# Altium schematic sheet ESP8266.SchDoc
size A3; Revision: 7
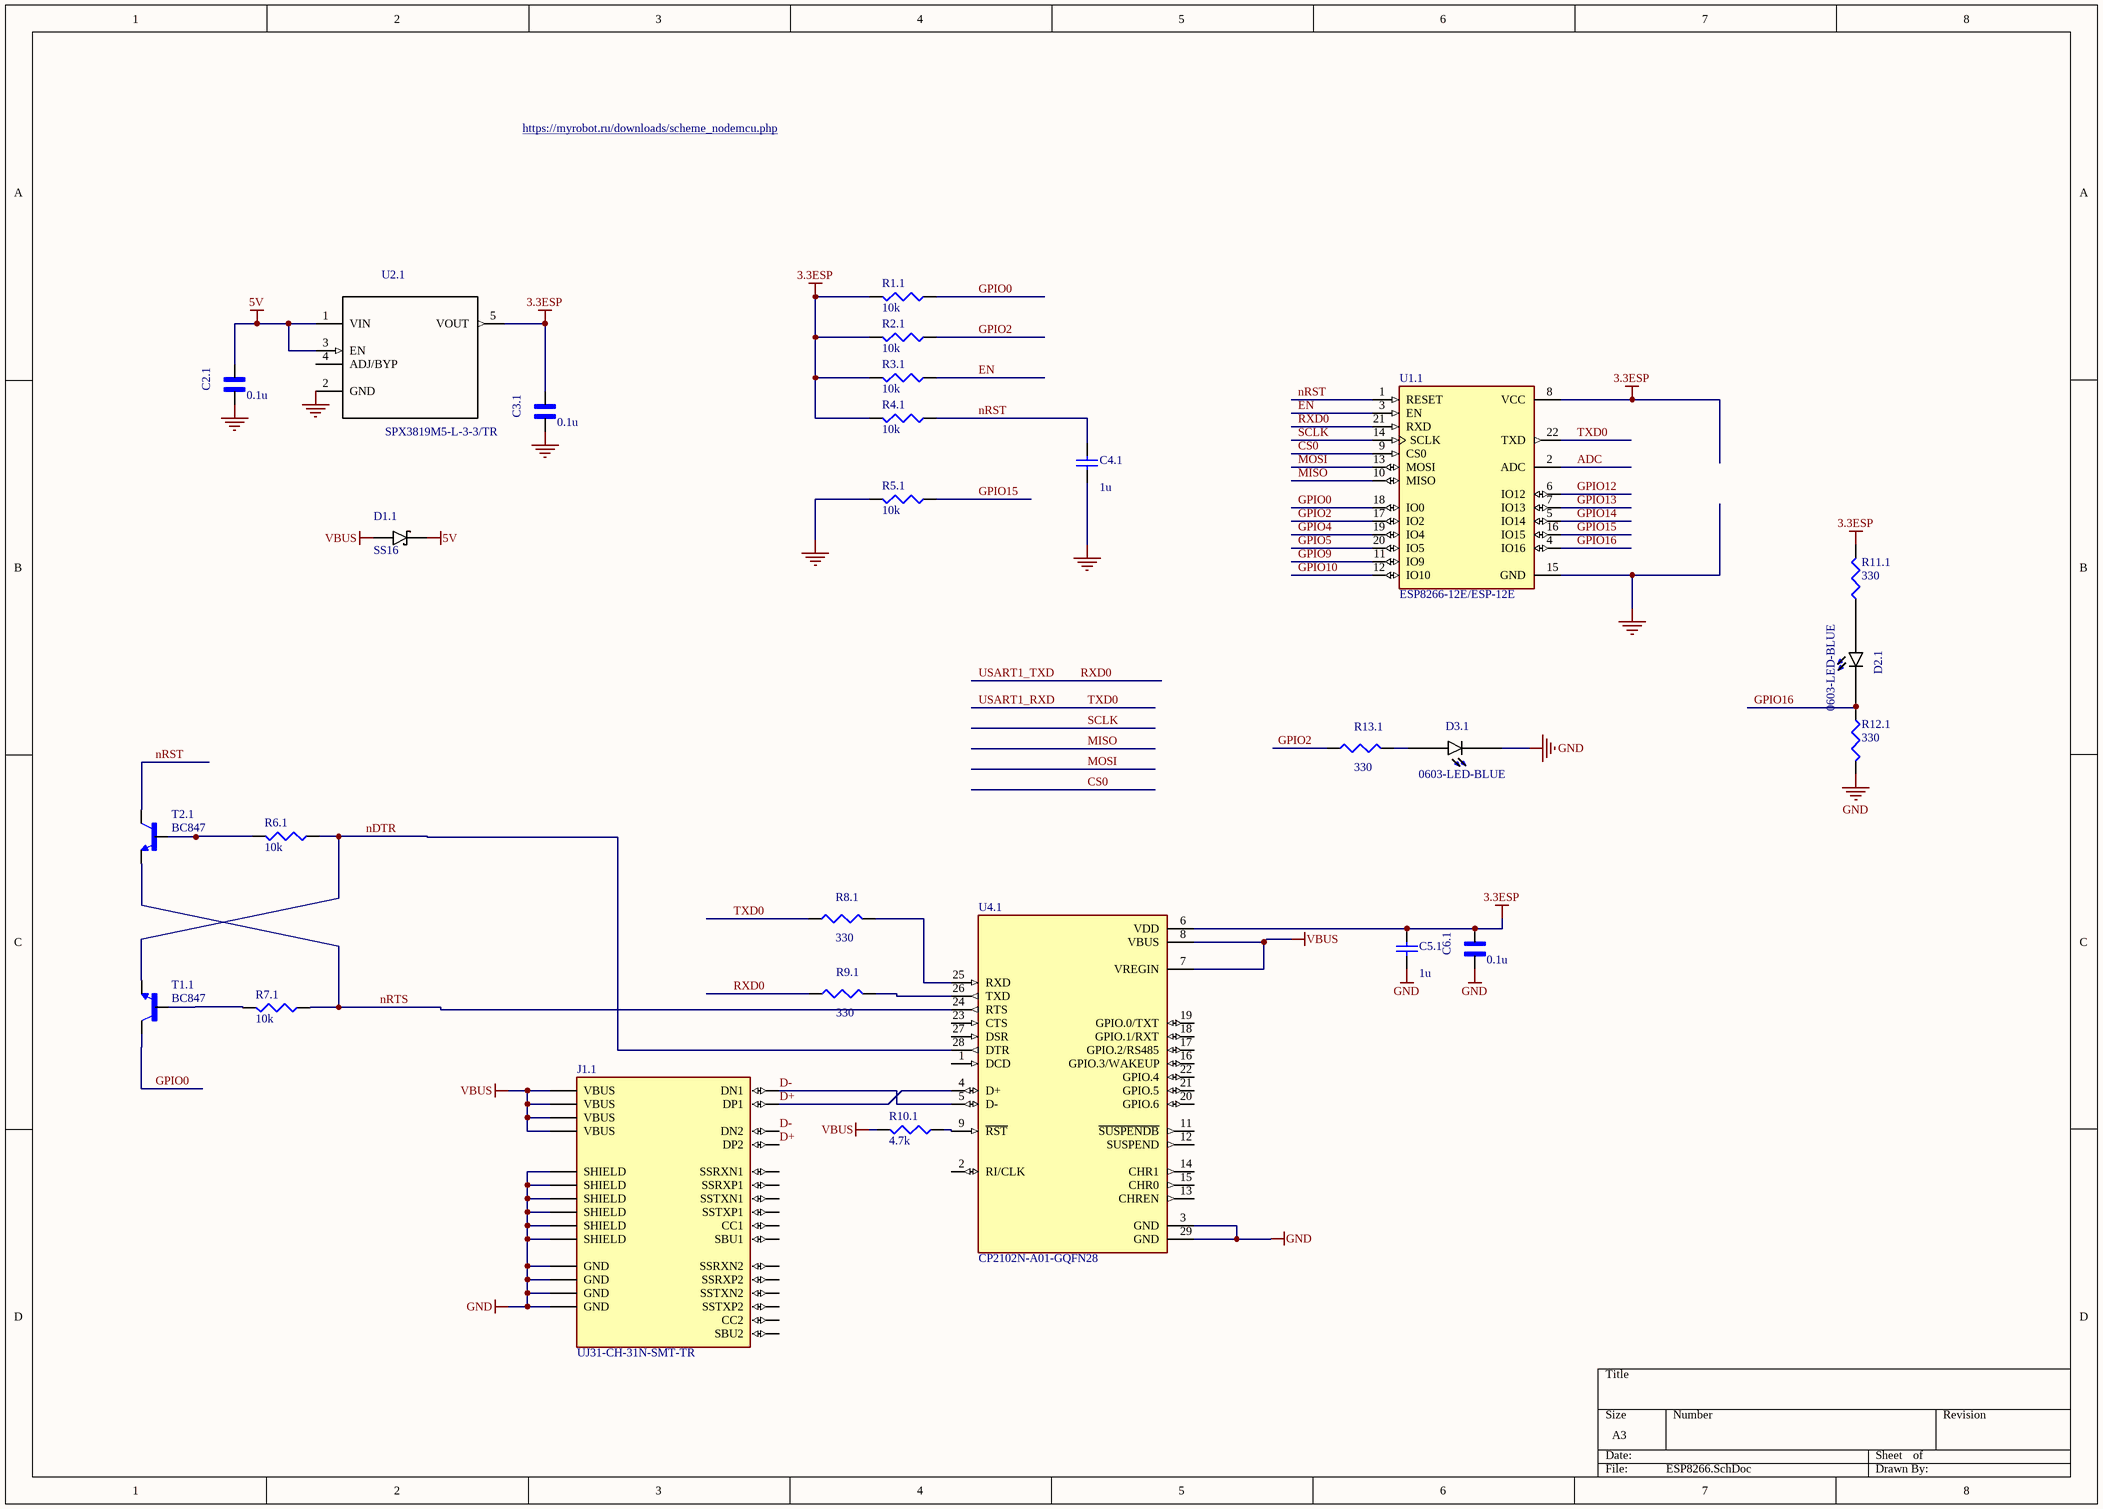
[diagram p0: ESP8266.SchDoc]

## Parts
C2.1  value 0.1u  [*CAPC1608X90]  (hidden comment: GX035C104MAT2-500)
C3.1  value 0.1u  [*CAPC1608X90]  (hidden comment: GX035C104MAT2-500)
C4.1  value 1u  [1608[0603]]  (hidden comment: Cap Semi)
C5.1  value 1u  [1608[0603]]  (hidden comment: Cap Semi)
C6.1  value 0.1u  [*CAPC1608X90]  (hidden comment: GX035C104MAT2-500)
D1.1  SS16  [*DIOM5227X250N_SS16(Primary)]
D2.1  0603-LED-BLUE  [*LEDM1608X80_LTE-C1906R-14(Primary)]
D3.1  0603-LED-BLUE  [*LEDM1608X80_LTE-C1906R-14(Primary)]
J1.1  UJ31-CH-31N-SMT-TR  [CUI_UJ31-CH-31N-SMT-TR]
R1.1  value 10k  [J1-0603]  (hidden comment: Res3)
R2.1  value 10k  [J1-0603]  (hidden comment: Res3)
R3.1  value 10k  [J1-0603]  (hidden comment: Res3)
R4.1  value 10k  [J1-0603]  (hidden comment: Res3)
R5.1  value 10k  [J1-0603]  (hidden comment: Res3)
R6.1  value 10k  [J1-0603]  (hidden comment: Res3)
R7.1  value 10k  [J1-0603]  (hidden comment: Res3)
R8.1  value 330  [J1-0603]  (hidden comment: Res3)
R9.1  value 330  [J1-0603]  (hidden comment: Res3)
R10.1  value 4.7k  [J1-0603]  (hidden comment: Res3)
R11.1  value 330  [J1-0603]  (hidden comment: Res3)
R12.1  value 330  [J1-0603]  (hidden comment: Res3)
R13.1  value 330  [J1-0603]  (hidden comment: Res3)
T1.1  BC847  [SOT23]
T2.1  BC847  [SOT23]
U1.1  ESP8266-12E/ESP-12E  [XCVR_ESP8266-12E/ESP-12E]
U2.1  SPX3819M5-L-3-3/TR  [*SOT95P280X145-5N]
U4.1  CP2102N-A01-GQFN28  [QFN50P500X500X80-29N]

## Nets
3.3ESP: C3.1.1 C5.1.1 C6.1.1 R1.1.2 R2.1.2 R3.1.2 R4.1.2 R11.1.2 U1.1.8(VCC) U2.1.5(VOUT) U4.1.6(VDD)
5V: C2.1.1 D1.1.C(K) U2.1.1(VIN) U2.1.3(EN)
GND: C2.1.2 C3.1.2 C4.1.2 C5.1.2 C6.1.2 D3.1.C J1.1.A1(GND) J1.1.A12(GND) J1.1.B1(GND) J1.1.B12(GND) J1.1.SH1(SHIELD) J1.1.SH2(SHIELD) J1.1.SH3(SHIELD) J1.1.SH4(SHIELD) J1.1.SH5(SHIELD) J1.1.SH6(SHIELD) R5.1.2 R12.1.2 U1.1.15(GND) U2.1.2(GND) U4.1.3(GND) U4.1.29(GND)
VBUS: D1.1.A J1.1.A4(VBUS) J1.1.A9(VBUS) J1.1.B4(VBUS) J1.1.B9(VBUS) R10.1.2 U4.1.7(VREGIN) U4.1.8(VBUS)
ADC: U1.1.2(ADC)
CS0: U1.1.9(CS0)
D+: J1.1.A6(DP1) J1.1.B6(DP2) U4.1.4(D+)
D-: J1.1.A7(DN1) J1.1.B7(DN2) U4.1.5(D-)
EN: R3.1.1 U1.1.3(EN)
GPIO0: R1.1.1 T1.1.3(C) U1.1.18(IO0)
GPIO2: R2.1.1 R13.1.1 U1.1.17(IO2)
GPIO4: U1.1.19(IO4)
GPIO5: U1.1.20(IO5)
GPIO9: U1.1.11(IO9)
GPIO10: U1.1.12(IO10)
GPIO12: U1.1.6(IO12)
GPIO13: U1.1.7(IO13)
GPIO14: U1.1.5(IO14)
GPIO15: R5.1.1 U1.1.16(IO15)
GPIO16: D2.1.C R12.1.1 U1.1.4(IO16)
MISO: U1.1.10(MISO)
MOSI: U1.1.13(MOSI)
nDTR: R6.1.1 T1.1.2(E) U4.1.28(DTR)
nRST: C4.1.1 R4.1.1 T2.1.3(C) U1.1.1(RESET)
nRTS: R7.1.1 T2.1.2(E) U4.1.24(RTS)
RXD0: R9.1.1 U1.1.21(RXD)  [also labelled USART1_TXD]
SCLK: U1.1.14(SCLK)
TXD0: R8.1.1 U1.1.22(TXD)  [also labelled USART1_RXD]
NetD2.1_A: D2.1.A R11.1.1
NetD3.1_A: D3.1.A R13.1.2
NetR6.1_2: R6.1.2 T2.1.1(B)
NetR7.1_2: R7.1.2 T1.1.1(B)
NetR8.1_2: R8.1.2 U4.1.25(RXD)
NetR9.1_2: R9.1.2 U4.1.26(TXD)
NetR10.1_1: R10.1.1 U4.1.9(~{RST})

Not connected (* = marked no-connect by the designer): J1.1 A2(SSTXP1) A3(SSTXN1) A5(CC1) A8(SBU1) A10(SSRXN2) A11(SSRXP2) B2(SSTXP2) B3(SSTXN2) B5(CC2) B8(SBU2) B10(SSRXN1) B11(SSRXP1); U2.1 4(ADJ/BYP); U4.1 1(DCD) 2(RI/CLK) 11(~{SUSPENDB}) 12(SUSPEND) 13(CHREN) 14(CHR1) 15(CHR0) 16(GPIO.3/WAKEUP) 17(GPIO.2/RS485) 18(GPIO.1/RXT) 19(GPIO.0/TXT) 20(GPIO.6) 21(GPIO.5) 22(GPIO.4) 23(CTS) 27(DSR)

## Notes on the sheet
- https://myrobot.ru/downloads/scheme_nodemcu.php

## Library data of the parts
C2.1 C3.1 = GX035C104MAT2-500: Cap Thin Film 0.1uf 50v 0603; MF: AVX; Pacage Metric: 1608; Type: SMD; Package: 0603 AVX; MP: GX035C104MAT2-500; SnapEDA_Link: https://www.snapeda.com/parts/GX035C104MAT2-500/AVX/view-part/?ref=snap
C4.1 C5.1 = Cap Semi: Capacitor (Semiconductor SIM Model); Published: 8-Jun-2000; LatestRevisionDate: 29-May-2009; LatestRevisionNote: IPC-7351 Footprint Added.; PackageReference: C1206; Publisher: Altium Limited; PackageDescription: Chip Capacitor
C6.1 = GX035C104MAT2-500: Cap Thin Film 0.1uf 50v 0603; MF: AVX; MP: GX035C104MAT2-500 or CL10B104JB8NNNC; Pacage Metric: 1608; Type: SMD; Package: 0603 AVX; SnapEDA_Link: https://www.snapeda.com/parts/GX035C104MAT2-500/AVX/view-part/?ref=snap
D1.1 = SS16: Diode Schottky 60V 1A Surface Mount SMA; Type: SMD; SnapEDA_Link: https://www.snapeda.com/parts/SS16/ON%20Semiconductor/view-part/?ref=search&t=ss16; Value: *; ChipDip_Link: https://www.chipdip.ru/product/ss16; MP: SS16; Package: SMA-2
D2.1 D3.1 = LTE-C1906R-14: LED IrLED Chip LED 2-Pin SMD T/R; Package: 0603 Lite-On; MP: 0603-LED-BLUE; SnapEDA_Link: https://www.snapeda.com/parts/LTE-C1906R-14/Lite-On%20Inc./view-part/?ref=snap; Value: *; Type: SMD
J1.1 = UJ31-CH-31N-SMT-TR: Type C, USB 3.1 Gen 2, 5 A, Right Angle, Surface Mount _SMT_, USB Receptacle; MF: CUI Devices; Value: *; SnapEDA_Link: https://www.snapeda.com/parts/UJ31-CH-31N-SMT-TR/CUI%20Devices/view-part/2776725/?ref=snap; Availability: Unavailable; Price: None; Package: None; MP: UJ31-CH-31N-SMT-TR; ChipDip_Link: https://www.chipdip.ru/product1/8002862225; HelpURL: https://www.chipdip.ru/product1/8002862225
R1.1 R2.1 R3.1 R4.1 R5.1 R6.1 R7.1 = Res3: Resistor; Pacage Metric: 1608; MP: 10K 1% 0603; ChipDip_Link: https://www.chipdip.ru/product0/9000079736; HelpURL: https://www.chipdip.ru/product0/9000079736; Package: R0603; Type: SMD
R8.1 R9.1 R11.1 R12.1 R13.1 = Res3: Resistor; Pacage Metric: 1608; MP: RC0603FR-07330RL; ChipDip_Link: https://www.chipdip.ru/product0/9000079628; HelpURL: https://www.chipdip.ru/product0/9000079628; Package: R0603; Type: SMD
R10.1 = Res3: Resistor; Pacage Metric: 1608; MP: 4.7K 1% 0603; ChipDip_Link: https://www.chipdip.ru/product0/9000079736; HelpURL: https://www.chipdip.ru/product0/9000079736; Package: R0603; Type: SMD
T1.1 T2.1 = BC847: <b>NPN TRANSISTOR</b>; MF: {'manufacturer': u'Rectron'}; Package: None; MP: BC847; Value: *; Availability: Unavailable; Price: None
U1.1 = ESP8266-12E/ESP-12E: ESP-12E WiFi Module; MF: {'manufacturer': u'AI-Thinker'}; Price: None; MP: ESP8266-12E/ESP-12E; Availability: Unavailable; Value: *; Package: None
U2.1 = SPX3819M5-L: Low Dropout Voltage Regulator, Adjustable 0.5A, В±1%, 2.5 to 16 Vin, 5-Pin SOT-23; MF: MaxLinear, Inc.; Value: 3V3; MP: SPX3819M5-L-3-3/TR; Package: SOT-23-5 Exar; SnapEDA_Link: https://www.snapeda.com/parts/SPX3819M5-L/MaxLinear%2C%20Inc./view-part/?ref=snap; Type: SMD; ChipDip_Link: https://www.chipdip.ru/product1/8003455237; HelpURL: http://www.farnell.com/datasheets/2614478.pdf
U4.1 = CP2102N-A01-GQFN28: Ic Bridge Usb To Uart 28qfn; MF: {'manufacturer': u'Silicon Labs'}; MP: CP2102N-A01-GQFN28; Value: *; Package: None; Price: None; Availability: Unavailable